# EAGLE design SolarCharge (EAGLE 9.6.2)
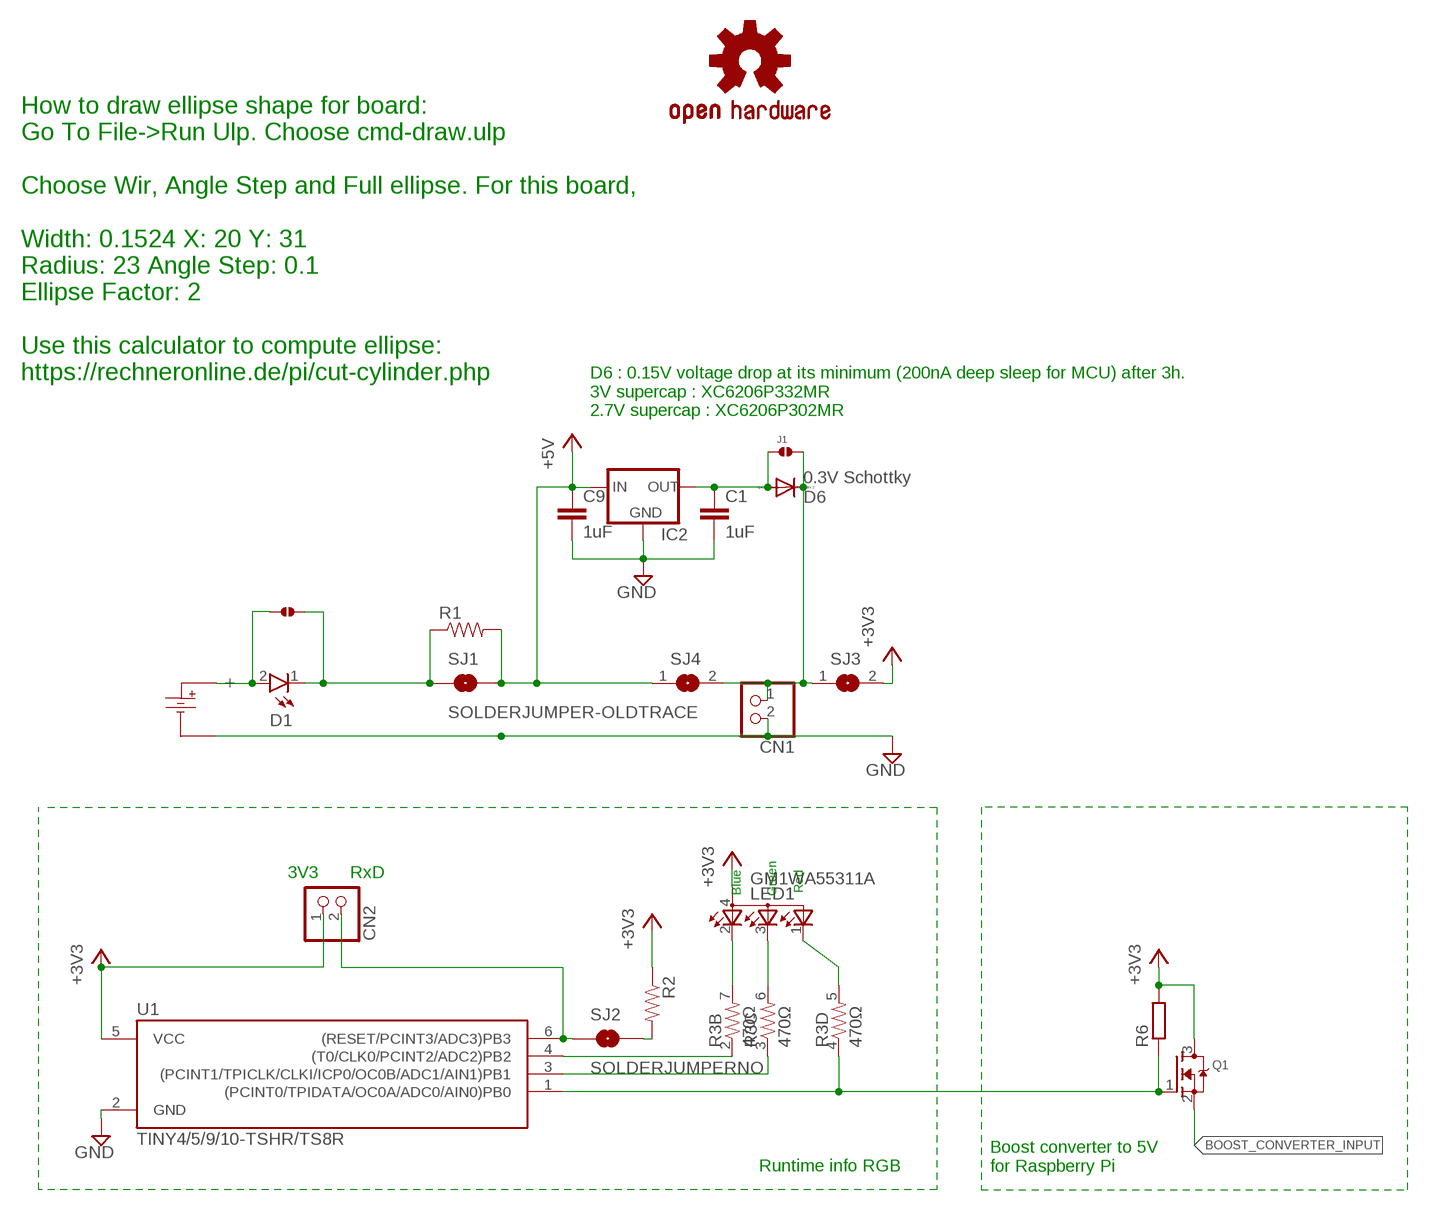
[diagram p0: schematic, sheet 1]

## Parts
C1  1uF  C-EUC0603  [C0603]
C9  1uF  C-EUC0603  [C0603]
CN1  JST_2PIN-SMT-RA  [JST-PH-2-SMT-RA]
CN2  JST_2PIN-SMT-RA  [JST-PH-2-SMT-RA]
D1  WL-SWTP3014  [WL-SWTP_3014]
D6  0.3V Schottky  DIODE-SOD523  [SOD523]
IC2  MCP1700TT  [SOT-23]
J1  SOLDERJUMPER.2.MED  [2.MED]
J3  SOLDERJUMPER.2.XL  [2.XL]
LED1  GM1WA55311A  [GM1WA55311A]
LOGO1  OSHW-LOGOM  [OSHW-LOGO-M]
Q1  MOSFET-NREFLOW  [SOT23]
R1  RESISTOR0603-RES  [0603-RES]
R2  RESISTOR0603-RES  [0603-RES]
R3  470Ω  RESISTOR-ARRAY0603-ARV  [0603-ARV]
R6  R-EU_R0603  [R0603]
SJ1  SOLDERJUMPER-OLDTRACE  [SJ_2S-TRACE]
SJ2  SOLDERJUMPERNO  [SJ_2S-NO]
SJ3  SJ  [SJ]
SJ4  SJ  [SJ]
U1  TINY4/5/9/10-TSHR/TS8R  [SOT-23-6]
U$1  SOLAR_CELL_53_30  [SOLAR_CELL_53_30]

## Nets
+3V3: CN2.1 LED1.4(A) Q1.3(D) R2.1 R6.2 SJ3.2 U1.5(VCC)
+5V: C9.1 IC2.3(IN) R1.2 SJ1.2 SJ4.1
BLUE: R3.3 U1.3((PCINT1/TPICLK/CLKI/ICP0/OC0B/ADC1/AIN1)PB1)
BOOST_CONVERTER_INPUT: Q1.2(S)
GND: C1.2 C9.2 CN1.2 IC2.1(GND) U1.2(GND) U$1.P$2
GREEN: R3.2 U1.4((T0/CLK0/PCINT2/ADC2)PB2)
N$1: D1.2 J3.1 U$1.P$1
N$3: D1.1 J3.2 R1.1 SJ1.1
N$4: CN1.1 D6.C J1.2 SJ3.1 SJ4.2
N$5: LED1.3(CBLUE) R3.6
N$6: LED1.2(CRED) R3.7
N$7: R2.2 SJ2.2
N$25: C1.1 D6.A IC2.2(OUT) J1.1
RED: Q1.1(G) R3.4 R6.1 U1.1((PCINT0/TPIDATA/OC0A/ADC0/AIN0)PB0)
RED_RESISTOR: LED1.1(CGREEN) R3.5
RXD: CN2.2 SJ2.1 U1.6((RESET/PCINT3/ADC3)PB3)
Unconnected: R3.1 R3.8

## Notes on the sheet
- How to draw ellipse shape for board:
  Go To File->Run Ulp. Choose cmd-draw.ulp
  
  Choose Wir, Angle Step and Full ellipse. For this board,
  
  Width: 0.1524 X: 20 Y: 31
  Radius: 23 Angle Step: 0.1
  Ellipse Factor: 2
  
  Use this calculator to compute ellipse:
  https://rechneronline.de/pi/cut-cylinder.php
- D6 : 0.15V voltage drop at its minimum (200nA deep sleep for MCU) after 3h.
  3V supercap : XC6206P332MR
  2.7V supercap : XC6206P302MR
- Green
- Blue
- 3V3 | RxD
- Red
- Runtime info RGB
- Boost converter to 5V 
  for Raspberry Pi

## Library data of the parts
C1 C9 = rcl:C-EU: CAPACITOR, European symbol
CN1 CN2 = lio:JST_2PIN: JST 2-Pin Connectors of various flavors SMT-RA (S2B-PH-SM4) 4UConnector #17311 SMT (B2B-PH-SM4) THM-RA (S2B-PH) THM (B2B-PH)
D1 = Wurth_Elektronik_Optoelectronics_rev15c:WL-SWTP: WL-SWTP SMD White Top view PLCC LED Size 3014, PLCC2 Characteristics Fast switching No IR radiation High CRI Slim and miniature size Low power consumption Suitable for all SMT assembly methods Top view Wide viewing angle Various color temperatures Thermal resistance junction to solder point: 38 °K/W LED junction temperature: 130 °C Efficacy typ. 128 Im/W @ 5000 °K Applications Signal lights Indoor displays Backlights General illumination,industrial and commercial lighting systems Replacement for PLCC 3528 in T8/T5 <http://katalog.we-online.de/media/images/eipal/WL-SWTP_pf2.jpg> Details see: http://katalog.we-online.de/en/led/WL-SWTP/158301260?m Creation Date: 2015-01-06, 2015 (C) Wurth Elektronik
D6 = diode:DIODE-: DIODE
IC2 = MCP1700:MCP1700: Microchip MCP1700 positive regulator
J1 J3 = solderjumper:SOLDERJUMPER.2
LED1 = led:GM1WA55311A: Chip LED RGB Source: http://document.sharpsma.com/files/GM1WA55311A_SS.pdf
LOGO1 = Spark:OSHW-LOGO: Open Source Hardware Logo This logo indicates the piece of hardware it is found on incorporates a OSHW license and/or adheres to the definition of open source hardware found here: http://freedomdefined.org/OSHW
Q1 = adafruit:MOSFET-N: N-Channel Mosfet 2N7002E - 60V 260mA SOT23 [Digikey: 2N7002ET1GOSTR-ND] - REEL BSH103 - 30V 850mA SOT23 [Digikey: 568-5013-1-ND]
R1 R2 = ROHM:RESISTOR: Resistor Basic schematic elements and footprints for 0603, 1206, and PTH resistors.
R3 = SparkFun:RESISTOR-ARRAY: Array Chip Resistor Source: RS Component / Phycomp
R6 = rcl:R-EU_: RESISTOR, European symbol
SJ1 = SparkFun-Passives:SOLDERJUMPER-OLD: Solder Jumper Standard SMD solder jumper. Used to automate production. Two varients : Normally Open and Normally Closed are the same, but have different paste layers. NC will have a large amount of paste and should jumper during reflow.
SJ2 = SparkFun-Passives:SOLDERJUMPER: Solder Jumper Standard SMD solder jumper. Used to automate production. Two varients : Normally Open and Normally Closed are the same, but have different paste layers. NC will have a large amount of paste and should jumper during reflow.
SJ3 SJ4 = jumper:SJ: SMD solder JUMPER
U1 = bt_avr:TINY4/5/9/10: ATtiny4, ATtiny5, ATtiny9, ATtiny10 Atmel 8-bit AVR Microcontroller with 512/1024 Bytes In-System Programmable Flash Datasheet.pdf <http://www.atmel.com/Images/Atmel-8127-AVR-8-bit-Microcontroller-ATtiny4-ATtiny5-ATtiny9-ATtiny10_Datasheet.pdf>
U$1 = solar_panel_53_30:SOLAR_CELL_53_30

## Board
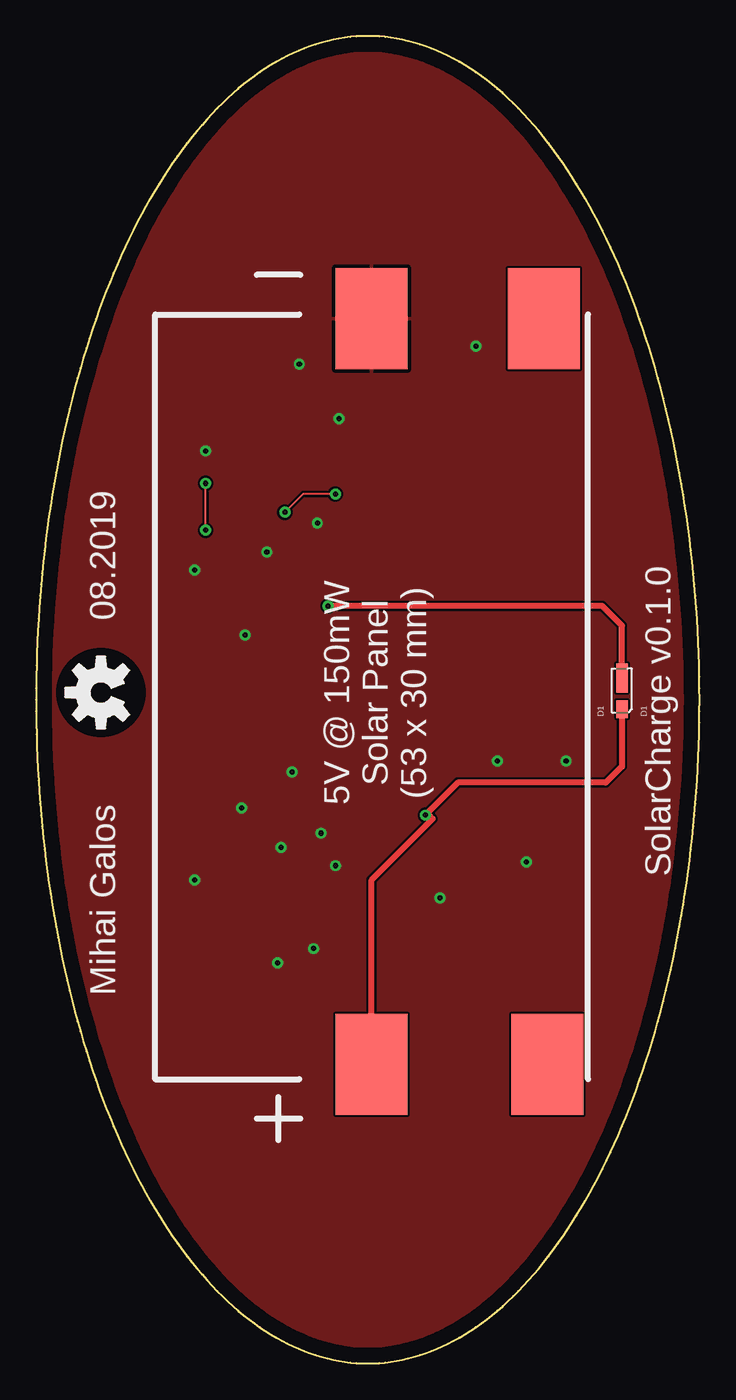
[diagram p1: board, top side]
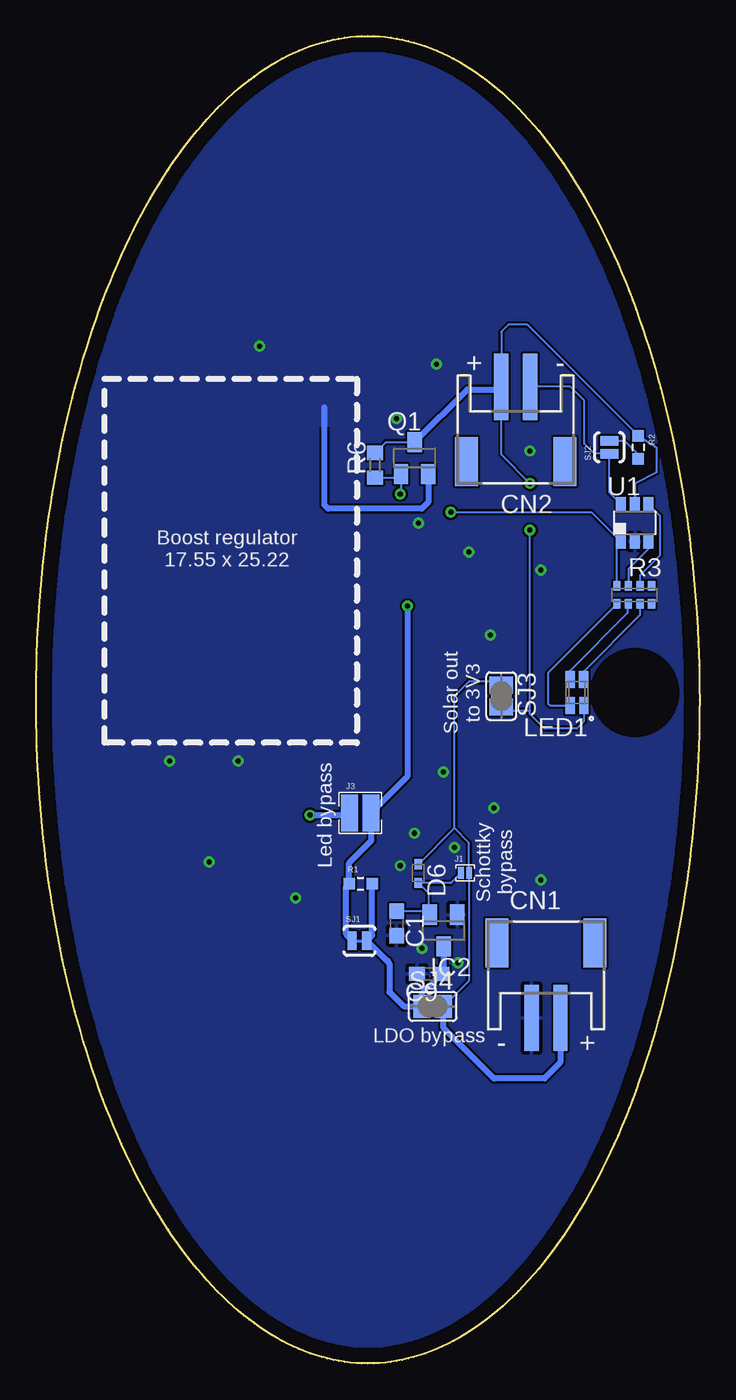
[diagram p2: board, bottom side, seen from below]

Size 46 x 92 mm. Coordinates in mm from the lower left corner, seen from the top.
Outline: 46,46 46,46.8 45.99,47.6 45.97,48.41 45.94,49.21 45.91,50.01 45.87,50.81 45.83,51.61 45.78,52.4 45.72,53.2 45.65,53.99 45.58,54.78 45.5,55.56 45.41,56.35 45.32,57.13 45.22,57.91 45.11,58.68 44.99,59.45 44.87,60.22 44.75,60.98 44.61,61.73 44.47,62.48 44.33,63.23 44.17,63.97 44.01,64.71 43.84,65.44 43.67,66.16 43.49,66.88 43.31,67.6 43.12,68.3 42.92,69 42.72,69.69 42.51,70.38 42.29,71.05 42.07,71.72 41.84,72.38 41.61,73.04 41.37,73.68 41.12,74.32 40.87,74.95 40.62,75.57 40.36,76.18 40.09,76.78 39.82,77.37 39.55,77.95 39.26,78.53 38.98,79.09 38.69,79.64 38.39,80.19 38.09,80.72 37.78,81.24 37.47,81.75 37.16,82.25 36.84,82.74 36.52,83.22 36.19,83.68 35.86,84.14 35.53,84.58 35.19,85.01 34.85,85.43 34.5,85.84 34.15,86.23 33.8,86.62 33.44,86.99 33.08,87.34 32.72,87.69 32.36,88.02 31.99,88.34 31.62,88.65 31.24,88.94 30.87,89.23 30.49,89.49 30.11,89.75 29.73,89.99 29.34,90.22 28.95,90.43 28.56,90.63 28.17,90.82 27.78,91 27.39,91.16 26.99,91.3 26.6,91.43 26.2,91.55 25.8,91.66 25.4,91.75 25,91.83 24.6,91.89 24.2,91.94 23.8,91.97 23.4,91.99 23,92 22.6,91.99 22.2,91.97 21.8,91.94 21.4,91.89 21,91.83 20.6,91.75 20.2,91.66 19.8,91.55 19.4,91.43 19.01,91.3 18.61,91.16 18.22,91 17.83,90.82 17.44,90.63 17.05,90.43 16.66,90.22 16.27,89.99 15.89,89.75 15.51,89.49 15.13,89.23 14.76,88.94 14.38,88.65 14.01,88.34 13.64,88.02 13.28,87.69 12.92,87.34 12.56,86.99 12.2,86.62 11.85,86.23 11.5,85.84 11.15,85.43 10.81,85.01 10.47,84.58 10.14,84.14 9.81,83.68 9.48,83.22 9.16,82.74 8.84,82.25 8.53,81.75 8.22,81.24 7.91,80.72 7.61,80.19 7.31,79.64 7.02,79.09 6.74,78.53 6.46,77.95 6.18,77.37 5.91,76.78 5.64,76.18 5.38,75.57 5.13,74.95 4.88,74.32 4.63,73.68 4.39,73.04 4.16,72.38 3.93,71.72 3.71,71.05 3.5,70.38 3.29,69.69 3.08,69 2.88,68.3 2.69,67.6 2.51,66.88 2.33,66.16 2.16,65.44 1.99,64.71 1.83,63.97 1.68,63.23 1.53,62.48 1.39,61.73 1.25,60.98 1.13,60.22 1,59.45 0.89,58.68 0.78,57.91 0.68,57.13 0.59,56.35 0.5,55.56 0.42,54.78 0.35,53.99 0.28,53.2 0.22,52.4 0.17,51.61 0.13,50.81 0.09,50.01 0.06,49.21 0.03,48.41 0.01,47.6 0,46.8 0,46 0,45.2 0.01,44.39 0.03,43.59 0.06,42.79 0.09,41.99 0.13,41.19 0.17,40.39 0.22,39.6 0.28,38.8 0.35,38.01 0.42,37.22 0.5,36.44 0.59,35.65 0.68,34.87 0.78,34.09 0.89,33.32 1,32.55 1.13,31.79 1.25,31.02 1.39,30.27 1.53,29.52 1.68,28.77 1.83,28.03 1.99,27.29 2.16,26.56 2.33,25.84 2.51,25.12 2.69,24.4 2.88,23.7 3.08,23 3.29,22.31 3.5,21.62 3.71,20.95 3.93,20.28 4.16,19.62 4.39,18.96 4.63,18.32 4.88,17.68 5.13,17.05 5.38,16.43 5.64,15.82 5.91,15.22 6.18,14.63 6.46,14.05 6.74,13.47 7.02,12.91 7.31,12.36 7.61,11.81 7.91,11.28 8.22,10.76 8.53,10.25 8.84,9.75 9.16,9.26 9.48,8.79 9.81,8.32 10.14,7.86 10.47,7.42 10.81,6.99 11.15,6.57 11.5,6.16 11.85,5.77 12.2,5.38 12.56,5.01 12.92,4.65 13.28,4.31 13.64,3.98 14.01,3.66 14.38,3.35 14.76,3.05 15.13,2.77 15.51,2.51 15.89,2.25 16.27,2.01 16.66,1.78 17.05,1.57 17.44,1.37 17.83,1.18 18.22,1.01 18.61,0.85 19.01,0.7 19.4,0.57 19.8,0.45 20.2,0.34 20.6,0.25 21,0.18 21.4,0.11 21.8,0.06 22.2,0.03 22.6,0.01 23,0 23.4,0.01 23.8,0.03 24.2,0.06 24.6,0.11 25,0.18 25.4,0.25 25.8,0.34 26.2,0.45 26.6,0.57 26.99,0.7 27.39,0.85 27.78,1.01 28.17,1.18 28.56,1.37 28.95,1.57 29.34,1.78 29.73,2.01 30.11,2.25 30.49,2.51 30.87,2.77 31.24,3.05 31.62,3.35 31.99,3.66 32.36,3.98 32.72,4.31 33.08,4.65 33.44,5.01 33.8,5.38 34.15,5.77 34.5,6.16 34.85,6.57 35.19,6.99 35.53,7.42 35.86,7.86 36.19,8.32 36.52,8.79 36.84,9.26 37.16,9.75 37.47,10.25 37.78,10.76 38.09,11.28 38.39,11.81 38.69,12.36 38.98,12.91 39.26,13.47 39.55,14.05 39.82,14.63 40.09,15.22 40.36,15.82 40.62,16.43 40.87,17.05 41.12,17.68 41.37,18.32 41.61,18.96 41.84,19.62 42.07,20.28 42.29,20.95 42.51,21.62 42.72,22.31 42.92,23 43.12,23.7 43.31,24.4 43.49,25.12 43.67,25.84 43.84,26.56 44.01,27.29 44.17,28.03 44.33,28.77 44.47,29.52 44.61,30.27 44.75,31.02 44.87,31.79 44.99,32.55 45.11,33.32 45.22,34.09 45.32,34.87 45.41,35.65 45.5,36.44 45.58,37.22 45.65,38.01 45.72,38.8 45.78,39.6 45.83,40.39 45.87,41.19 45.91,41.99 45.94,42.79 45.97,43.59 45.99,44.39 46,45.2 46,46
Copper layers (1*16): Top 0.035mm / dielectric 1.5mm / Bottom 0.035mm
Design rules "default": minimum track width 6mil, minimum drill 0.35mm, track to track 6mil, track to pad 6mil, pad to pad 6mil, via to via 6mil, smd to smd 6mil, copper to edge 40mil, drill to drill 6mil, minimum pad ring 10mil, minimum via ring 8mil, stop-mask expansion 4mil, vias tented up to drill 0mil, thermal gap 10mil
tRestrict: area 1.5,43.5 to 7.5,49.5
bRestrict: area 1.5,43.5 to 7.5,49.5

### Footprints (pad centres in the part's own frame; a part is rotated, then mirrored left to right if it is on the bottom)
C0603 = smd 1.1 x 1: 1 -0.85,0; 2 0.85,0
JST-PH-2-SMT-RA = smd 1 x 4.6: 1 1,-3.7; 2 -1,-3.7 | smd 1.6 x 3.4: NC1 -3.4,1.5; NC2 3.4,1.5
WL-SWTP_3014 = smd 2 x 0.8: 1 2.15,0 | smd 1.2 x 0.8: 2 0,0
SOD523 = smd 0.7 x 0.5: A 0.7,0; C -0.6,0
SOT-23 = smd 1 x 1.4: 1 -0.95,-1.1; 2 0.95,-1.1; 3 0,1.1
2.MED = smd 0.406 x 0.813: 1 -0.279,0; 2 0.279,0
2.XL = smd 1.168 x 2.54: 1 -0.735,0; 2 0.735,0
GM1WA55311A = smd 0.65 x 1.2: 1 0.477,0.9; 2 -0.475,-0.9; 3 0.475,-0.9; 4 -0.477,0.9
SOT23 = smd 1 x 1.4: 1 -0.95,-1.1; 2 0.95,-1.1; 3 0,1.1
0603-RES = smd 0.8 x 0.8: 1 -0.8,0; 2 0.8,0
0603-ARV = smd 0.5 x 0.65: 1 -1.2,-0.625; 2 -0.4,-0.625; 3 0.4,-0.625; 4 1.2,-0.625; 5 1.2,0.625; 6 0.4,0.625; 7 -0.4,0.625; 8 -1.2,0.625
R0603 = smd 1 x 1.1: 1 -0.85,0; 2 0.85,0
SJ_2S-TRACE = smd 0.635 x 1.27: 1 -0.508,0; 2 0.508,0
SJ_2S-NO = smd 0.635 x 1.27: 1 -0.45,0; 2 0.45,0
SJ = smd 1.168 x 1.6: 1 -0.762,0; 2 0.762,0
SOT-23-6 = smd 0.69 x 0.99: 1 -0.95,-1.29; 2 0,-1.29; 3 0.95,-1.29; 4 0.95,1.3; 5 0,1.3; 6 -0.95,1.3
SOLAR_CELL_53_30 = smd 5 x 7: P$1 15,1.032; P$2 15,52.73; P$3 27.192,1.032; P$4 26.938,52.73

### Placement (x,y rotation side)
C1  21,30.5 270 bottom
C9  18.75,27 180 bottom
CN1  10.65,27.65 0 bottom
CN2  12.75,64 180 bottom
D1  40.62,45.35 90 top
D6  19.5,34 270 bottom
IC2  17.75,30 180 bottom
J1  16.25,34 0 bottom
J3  23.52,38.15 0 bottom
LED1  8.5,46.5 180 bottom
LOGO1  4.5,46.5 90 top
Q1  19.75,62.75 0 bottom
R1  23.5,33.25 0 bottom
R2  4.25,63.5 270 bottom
R3  4.53,53.26 180 bottom
R6  22.5,62.25 90 bottom
SJ1  23.57,29.3 0 bottom
SJ2  6.25,63.5 90 bottom
SJ3  13.75,46.25 270 bottom
SJ4  18.5,24.75 0 bottom
U1  4.5,58.25 0 bottom
U$1  8.26,19.7 0 top

### Tracks (layer width: path | path; a pad name or v marks a point on that pad's centre or on a via)
+3V3  (via drill 0.35)
  Top 0.152: v11.75,57.75 v11.75,61
  Bottom 0.152: v11.75,61 13.75,63 13.75,67.5 CN2.1 13.75,71.5 13.25,72 11.95,72 R2.1 3,63.5 3,61.75 4.5,61 U1.5 | LED1.4 8.02,44.48 8.5,44 10.75,44 11.75,45 11.75,45.25 | R6.2 21.75,63.85 Q1.3 | 11.75,45.25 v11.75,57.75 | SJ3.2 13.51,45.25 11.75,45.25
  Bottom 0.406: Q1.3 16.1,67.5 13.75,67.5
+5V
  Bottom 0.152: 18.2,26.7 C9.1 17.75,27.15
  Bottom 0.406: R1.2 22.7,29.67 SJ1.2 21.63,27.87 | 21.63,27.87 21.5,27.73 21.5,25.75 20.5,24.75 SJ4.1 19.26,25.64 18.2,26.7 | 21.63,27.92 21.63,27.87 | IC2.3 17.75,27.15
BLUE
  Bottom 0.152: U1.3 3.55,56.45 4.93,55.07 R3.3
BOOST_CONVERTER_INPUT
  Bottom 0.406: Q1.2 18.8,59.7 19.25,59.25 25.75,59.25 26,59.5 26,66.25
  pour Bottom: 23.75,65 27.5,65 27.5,71.5 23.75,71.5
GND  (via drill 0.35)
  Top 0.406: 25.5,71.46 U$1.P$2
  other vias: 11.75,63.25 11,55 14.5,50.5 19.5,58.25 21,65.5 30.5,70.5 18.25,69.25 14.25,38.5 20.75,34.5 28,32.25 34,34.75 36.75,41.75 32,41.75 16,56.25 17.75,41 11,33.5 19.75,36.75 17,35.75 16.75,27.75 19.25,28.75
  pour Top: 46,46 46,46.8 45.99,47.61 45.97,48.41 45.94,49.21 45.91,50.01 45.87,50.81 45.83,51.61 45.78,52.4 45.72,53.2 45.65,53.99 45.58,54.78 45.5,55.56 45.41,56.35 45.32,57.13 45.22,57.91 45.11,58.68 45,59.45 44.87,60.21 44.75,60.98 44.61,61.73 44.47,62.48 44.33,63.23 44.17,63.97 44.01,64.71 43.85,65.44 43.67,66.17 43.49,66.88 43.31,67.6 43.12,68.3 42.92,69 42.71,69.69 42.51,70.38 42.29,71.05 42.07,71.72 41.84,72.38 41.61,73.04 41.37,73.68 41.12,74.32 40.87,74.95 40.62,75.57 40.36,76.18 40.09,76.78 39.82,77.37 39.54,77.95 39.26,78.53 38.98,79.09 38.69,79.64 38.39,80.18 38.09,80.72 37.78,81.24 37.47,81.75 37.16,82.25 36.84,82.74 36.52,83.21 36.19,83.68 35.86,84.14 35.53,84.58 35.19,85.01 34.85,85.43 34.5,85.84 34.15,86.23 33.8,86.62 33.44,86.99 33.08,87.34 32.72,87.69 32.35,88.02 31.99,88.34 31.62,88.65 31.24,88.94 30.87,89.23 30.49,89.49 30.11,89.75 29.72,89.99 29.34,90.22 28.95,90.43 28.56,90.63 28.17,90.82 27.78,90.99 27.39,91.15 26.99,91.3 26.6,91.43 26.2,91.55 25.8,91.66 25.4,91.75 25,91.82 24.6,91.89 24.2,91.94 23.8,91.97 23.4,91.99 23,92 22.6,91.99 22.2,91.97 21.8,91.94 21.4,91.89 21,91.82 20.6,91.75 20.2,91.66 19.8,91.55 19.4,91.43 19.01,91.3 18.61,91.15 18.22,90.99 17.83,90.82 17.44,90.63 17.05,90.43 16.66,90.22 16.28,89.99 15.89,89.75 15.51,89.49 15.13,89.23 14.76,88.94 14.38,88.65 14.01,88.34 13.65,88.02 13.28,87.69 12.92,87.34 12.56,86.99 12.2,86.62 11.85,86.23 11.5,85.84 11.15,85.43 10.81,85.01 10.47,84.58 10.14,84.14 9.81,83.68 9.48,83.21 9.16,82.74 8.84,82.25 8.53,81.75 8.22,81.24 7.91,80.72 7.61,80.18 7.31,79.64 7.02,79.09 6.74,78.53 6.46,77.95 6.18,77.37 5.91,76.78 5.64,76.18 5.38,75.57 5.13,74.95 4.88,74.32 4.63,73.68 4.39,73.04 4.16,72.38 3.93,71.72 3.71,71.05 3.49,70.38 3.29,69.69 3.08,69 2.88,68.3 2.69,67.6 2.51,66.88 2.33,66.17 2.15,65.44 1.99,64.71 1.83,63.97 1.67,63.23 1.53,62.48 1.39,61.73 1.25,60.98 1.13,60.21 1,59.45 0.89,58.68 0.78,57.91 0.68,57.13 0.59,56.35 0.5,55.56 0.42,54.78 0.35,53.99 0.28,53.2 0.22,52.4 0.17,51.61 0.13,50.81 0.09,50.01 0.06,49.21 0.03,48.41 0.01,47.61 0,46.8 0,46 0,45.2 0.01,44.39 0.03,43.59 0.06,42.79 0.09,41.99 0.13,41.19 0.17,40.39 0.22,39.6 0.28,38.8 0.35,38.01 0.42,37.22 0.5,36.44 0.59,35.65 0.68,34.87 0.78,34.09 0.89,33.32 1,32.55 1.13,31.79 1.25,31.02 1.39,30.27 1.53,29.52 1.67,28.77 1.83,28.03 1.99,27.29 2.15,26.56 2.33,25.83 2.51,25.12 2.69,24.4 2.88,23.7 3.08,23 3.29,22.31 3.49,21.62 3.71,20.95 3.93,20.28 4.16,19.62 4.39,18.96 4.63,18.32 4.88,17.68 5.13,17.05 5.38,16.43 5.64,15.82 5.91,15.22 6.18,14.63 6.46,14.05 6.74,13.47 7.02,12.91 7.31,12.36 7.61,11.82 7.91,11.28 8.22,10.76 8.53,10.25 8.84,9.75 9.16,9.26 9.48,8.79 9.81,8.32 10.14,7.86 10.47,7.42 10.81,6.99 11.15,6.57 11.5,6.16 11.85,5.77 12.2,5.38 12.56,5.01 12.92,4.66 13.28,4.31 13.65,3.98 14.01,3.66 14.38,3.35 14.76,3.06 15.13,2.77 15.51,2.51 15.89,2.25 16.28,2.01 16.66,1.78 17.05,1.57 17.44,1.37 17.83,1.18 18.22,1.01 18.61,0.85 19.01,0.7 19.4,0.57 19.8,0.45 20.2,0.34 20.6,0.25 21,0.18 21.4,0.11 21.8,0.06 22.2,0.03 22.6,0.01 23,0 23.4,0.01 23.8,0.03 24.2,0.06 24.6,0.11 25,0.18 25.4,0.25 25.8,0.34 26.2,0.45 26.6,0.57 26.99,0.7 27.39,0.85 27.78,1.01 28.17,1.18 28.56,1.37 28.95,1.57 29.34,1.78 29.72,2.01 30.11,2.25 30.49,2.51 30.87,2.77 31.24,3.06 31.62,3.35 31.99,3.66 32.35,3.98 32.72,4.31 33.08,4.66 33.44,5.01 33.8,5.38 34.15,5.77 34.5,6.16 34.85,6.57 35.19,6.99 35.53,7.42 35.86,7.86 36.19,8.32 36.52,8.79 36.84,9.26 37.16,9.75 37.47,10.25 37.78,10.76 38.09,11.28 38.39,11.82 38.69,12.36 38.98,12.91 39.26,13.47 39.54,14.05 39.82,14.63 40.09,15.22 40.36,15.82 40.62,16.43 40.87,17.05 41.12,17.68 41.37,18.32 41.61,18.96 41.84,19.62 42.07,20.28 42.29,20.95 42.51,21.62 42.71,22.31 42.92,23 43.12,23.7 43.31,24.4 43.49,25.12 43.67,25.83 43.85,26.56 44.01,27.29 44.17,28.03 44.33,28.77 44.47,29.52 44.61,30.27 44.75,31.02 44.87,31.79 45,32.55 45.11,33.32 45.22,34.09 45.32,34.87 45.41,35.65 45.5,36.44 45.58,37.22 45.65,38.01 45.72,38.8 45.78,39.6 45.83,40.39 45.87,41.19 45.91,41.99 45.94,42.79 45.97,43.59 45.99,44.39 46,45.2
  pour Bottom: 46,46 46,46.8 45.99,47.61 45.97,48.41 45.94,49.21 45.91,50.01 45.87,50.81 45.83,51.61 45.78,52.4 45.72,53.2 45.65,53.99 45.58,54.78 45.5,55.56 45.41,56.35 45.32,57.13 45.22,57.91 45.11,58.68 45,59.45 44.87,60.21 44.75,60.98 44.61,61.73 44.47,62.48 44.33,63.23 44.17,63.97 44.01,64.71 43.85,65.44 43.67,66.17 43.49,66.88 43.31,67.6 43.12,68.3 42.92,69 42.71,69.69 42.51,70.38 42.29,71.05 42.07,71.72 41.84,72.38 41.61,73.04 41.37,73.68 41.12,74.32 40.87,74.95 40.62,75.57 40.36,76.18 40.09,76.78 39.82,77.37 39.54,77.95 39.26,78.53 38.98,79.09 38.69,79.64 38.39,80.18 38.09,80.72 37.78,81.24 37.47,81.75 37.16,82.25 36.84,82.74 36.52,83.21 36.19,83.68 35.86,84.14 35.53,84.58 35.19,85.01 34.85,85.43 34.5,85.84 34.15,86.23 33.8,86.62 33.44,86.99 33.08,87.34 32.72,87.69 32.35,88.02 31.99,88.34 31.62,88.65 31.24,88.94 30.87,89.23 30.49,89.49 30.11,89.75 29.72,89.99 29.34,90.22 28.95,90.43 28.56,90.63 28.17,90.82 27.78,90.99 27.39,91.15 26.99,91.3 26.6,91.43 26.2,91.55 25.8,91.66 25.4,91.75 25,91.82 24.6,91.89 24.2,91.94 23.8,91.97 23.4,91.99 23,92 22.6,91.99 22.2,91.97 21.8,91.94 21.4,91.89 21,91.82 20.6,91.75 20.2,91.66 19.8,91.55 19.4,91.43 19.01,91.3 18.61,91.15 18.22,90.99 17.83,90.82 17.44,90.63 17.05,90.43 16.66,90.22 16.28,89.99 15.89,89.75 15.51,89.49 15.13,89.23 14.76,88.94 14.38,88.65 14.01,88.34 13.65,88.02 13.28,87.69 12.92,87.34 12.56,86.99 12.2,86.62 11.85,86.23 11.5,85.84 11.15,85.43 10.81,85.01 10.47,84.58 10.14,84.14 9.81,83.68 9.48,83.21 9.16,82.74 8.84,82.25 8.53,81.75 8.22,81.24 7.91,80.72 7.61,80.18 7.31,79.64 7.02,79.09 6.74,78.53 6.46,77.95 6.18,77.37 5.91,76.78 5.64,76.18 5.38,75.57 5.13,74.95 4.88,74.32 4.63,73.68 4.39,73.04 4.16,72.38 3.93,71.72 3.71,71.05 3.49,70.38 3.29,69.69 3.08,69 2.88,68.3 2.69,67.6 2.51,66.88 2.33,66.17 2.15,65.44 1.99,64.71 1.83,63.97 1.67,63.23 1.53,62.48 1.39,61.73 1.25,60.98 1.13,60.21 1,59.45 0.89,58.68 0.78,57.91 0.68,57.13 0.59,56.35 0.5,55.56 0.42,54.78 0.35,53.99 0.28,53.2 0.22,52.4 0.17,51.61 0.13,50.81 0.09,50.01 0.06,49.21 0.03,48.41 0.01,47.61 0,46.8 0,46 0,45.2 0.01,44.39 0.03,43.59 0.06,42.79 0.09,41.99 0.13,41.19 0.17,40.39 0.22,39.6 0.28,38.8 0.35,38.01 0.42,37.22 0.5,36.44 0.59,35.65 0.68,34.87 0.78,34.09 0.89,33.32 1,32.55 1.13,31.79 1.25,31.02 1.39,30.27 1.53,29.52 1.67,28.77 1.83,28.03 1.99,27.29 2.15,26.56 2.33,25.83 2.51,25.12 2.69,24.4 2.88,23.7 3.08,23 3.29,22.31 3.49,21.62 3.71,20.95 3.93,20.28 4.16,19.62 4.39,18.96 4.63,18.32 4.88,17.68 5.13,17.05 5.38,16.43 5.64,15.82 5.91,15.22 6.18,14.63 6.46,14.05 6.74,13.47 7.02,12.91 7.31,12.36 7.61,11.82 7.91,11.28 8.22,10.76 8.53,10.25 8.84,9.75 9.16,9.26 9.48,8.79 9.81,8.32 10.14,7.86 10.47,7.42 10.81,6.99 11.15,6.57 11.5,6.16 11.85,5.77 12.2,5.38 12.56,5.01 12.92,4.66 13.28,4.31 13.65,3.98 14.01,3.66 14.38,3.35 14.76,3.06 15.13,2.77 15.51,2.51 15.89,2.25 16.28,2.01 16.66,1.78 17.05,1.57 17.44,1.37 17.83,1.18 18.22,1.01 18.61,0.85 19.01,0.7 19.4,0.57 19.8,0.45 20.2,0.34 20.6,0.25 21,0.18 21.4,0.11 21.8,0.06 22.2,0.03 22.6,0.01 23,0 23.4,0.01 23.8,0.03 24.2,0.06 24.6,0.11 25,0.18 25.4,0.25 25.8,0.34 26.2,0.45 26.6,0.57 26.99,0.7 27.39,0.85 27.78,1.01 28.17,1.18 28.56,1.37 28.95,1.57 29.34,1.78 29.72,2.01 30.11,2.25 30.49,2.51 30.87,2.77 31.24,3.06 31.62,3.35 31.99,3.66 32.35,3.98 32.72,4.31 33.08,4.66 33.44,5.01 33.8,5.38 34.15,5.77 34.5,6.16 34.85,6.57 35.19,6.99 35.53,7.42 35.86,7.86 36.19,8.32 36.52,8.79 36.84,9.26 37.16,9.75 37.47,10.25 37.78,10.76 38.09,11.28 38.39,11.82 38.69,12.36 38.98,12.91 39.26,13.47 39.54,14.05 39.82,14.63 40.09,15.22 40.36,15.82 40.62,16.43 40.87,17.05 41.12,17.68 41.37,18.32 41.61,18.96 41.84,19.62 42.07,20.28 42.29,20.95 42.51,21.62 42.71,22.31 42.92,23 43.12,23.7 43.31,24.4 43.49,25.12 43.67,25.83 43.85,26.56 44.01,27.29 44.17,28.03 44.33,28.77 44.47,29.52 44.61,30.27 44.75,31.02 44.87,31.79 45,32.55 45.11,33.32 45.22,34.09 45.32,34.87 45.41,35.65 45.5,36.44 45.58,37.22 45.65,38.01 45.72,38.8 45.78,39.6 45.83,40.39 45.87,41.19 45.91,41.99 45.94,42.79 45.97,43.59 45.99,44.39 46,45.2
GREEN
  Bottom 0.152: 3.3,59.55 U1.4 2.75,58.75 2.75,56 4.13,54.62 R3.2
N$1  (via drill 0.35)
  Top 0.406: U$1.P$1 23.26,33.51 27.5,37.75 27.25,38 v27,38 29.25,40.25 39.5,40.25 40.62,41.37 D1.2
  Bottom 0.406: v27,38 24.41,38 J3.1
N$3  (via drill 0.35)
  Top 0.406: D1.1 40.62,51.13 39.25,52.5 v20.25,52.5
  Bottom 0.406: v20.25,52.5 20.25,40.69 J3.2 22.75,38.11 22.75,36.25 24.3,34.7 R1.1 24.5,33.05 24.5,29.75 24.08,29.33 SJ1.1
N$4
  Bottom 0.152: SJ3.1 13.99,47.25 16,47.25 17,46.25 17,37.1 | D6.C 17,37.1 | 17,37.1 15.97,36.07 J1.2 15.97,26.52 17.75,24.74
  Bottom 0.406: CN1.1 9.65,20.85 10.75,19.75 14.25,19.75 17.75,23.25 17.75,24.74 SJ4.2
N$5
  Bottom 0.152: LED1.3 9,47.42 9,48 5,52 5,52.57 R3.6
N$6
  Bottom 0.152: LED1.2 8,47.42 8,48 4.13,51.87 R3.7
N$7
  Bottom 0.152: SJ2.2 5.2,63.95 4.25,63 R2.2
N$25
  Bottom 0.152: C1.1 18.95,31.35 18.8,31.2 | 18.8,31.2 IC2.2 | 18.8,31.2 18.8,32.6 D6.A 17.23,33.3 J1.1
PAD_BOOST1
  pour Bottom: 37.25,65 41,65 41,71.5 37.25,71.5
PAD_BOOST2
  pour Bottom: 24,43.25 28,43.25 28,47.25 24,47.25
PAD_BOOST3
  pour Bottom: 37,43.25 41,43.25 41,47.25 37,47.25
RED  (via drill 0.35)
  Top 0.152: v20.75,60.25 18.5,60.25 v17.25,59
  Bottom 0.152: R3.4 5.73,56.68 U1.1 7.49,59 v17.25,59 | v20.75,60.25 20.7,60.25 Q1.1 20.95,61.4 R6.1
RED_RESISTOR
  Bottom 0.152: 5.84,52.75 R3.5 10.5,47.87 10.5,45.75 10.35,45.6 LED1.1
RXD
  Bottom 0.152: 11.55,67.5 CN2.2 8.95,67.7 8,66.75 8,63.75 7.3,63.05 SJ2.1 6.25,60.35 U1.6

### Text on the board
tPlace: 08.2019 | 5V @ 150mW / Solar Panel / (53 x 30 mm) | SolarCharge v0.1.0 | Mihai Galos
bPlace: Boost regulator / 17.55 x 25.22 | Solar out / to 3V3 | Led bypass | Schottky / bypass | LDO bypass
bStop: In | Out
Measures: Use pipe of 65mm?